# Altium schematic sheet B38_LCM.SchDoc
size A3; SheetNumber: 10; SheetTotal: 11
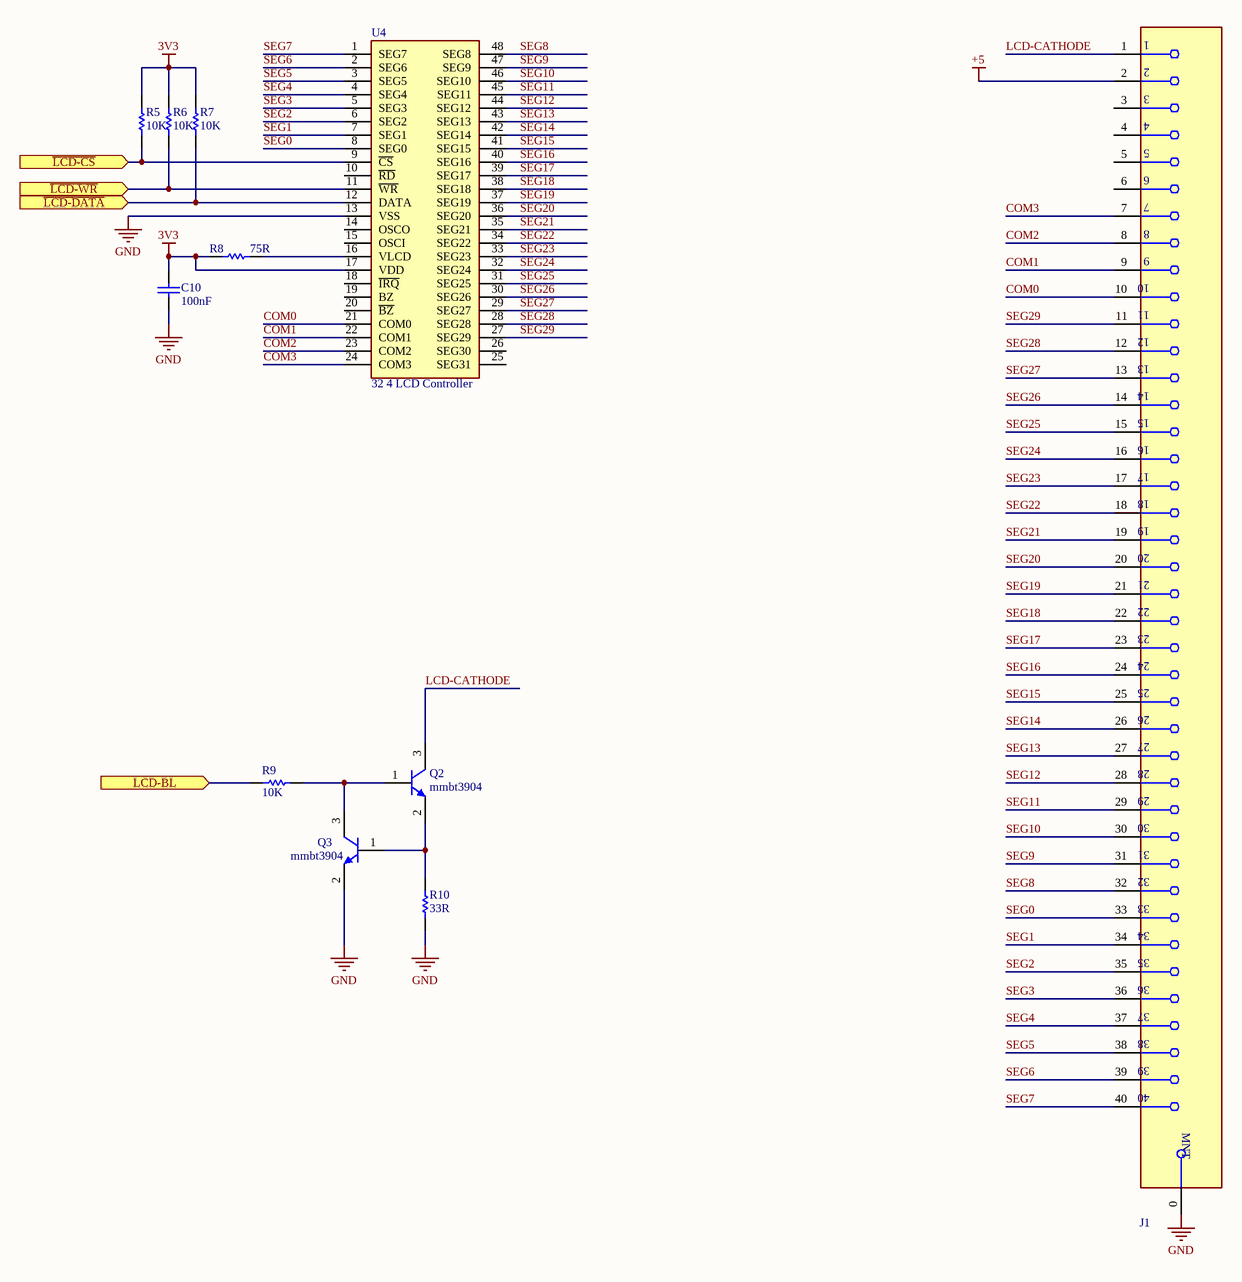
[diagram p0: B38_LCM.SchDoc]

## Parts
C10  100nF  [CAP0603]
J1  4-1734592-0  [FFC40PIN TOP]  (value not drawn)
Q2  mmbt3904  [SOT-23]
Q3  mmbt3904  [SOT-23]
R5  10K  [RES0603]
R6  10K  [RES0603]
R7  10K  [RES0603]
R8  75R  [RES0603]
R9  10K  [RES0603]
R10  33R  [RES0603]
U4  32 4 LCD Controller  [SOP64P1035X277-48N]

## Ports
LCD-BL (in), ~{LCD-CS} (in), ~{LCD-DATA} (in), ~{LCD-WR} (in)

## Nets
3V3: C10.1 R5.1 R6.1 R7.1 R8.1 U4.17(VDD)
+5: J1.2
GND: C10.2 J1.0(MNT_1) Q3.2(E) R10.1 U4.13(VSS)
COM0: J1.10 U4.21(COM0)
COM1: J1.9 U4.22(COM1)
COM2: J1.8 U4.23(COM2)
COM3: J1.7 U4.24(COM3)
~{LCD-CS}: R5.2 U4.9(~{CS}) ; port ~{LCD-CS}
~{LCD-DATA}: R7.2 U4.12(DATA) ; port ~{LCD-DATA}
~{LCD-WR}: R6.2 U4.11(~{WR}) ; port ~{LCD-WR}
LCD-BL: R9.2 ; port LCD-BL
LCD-CATHODE: J1.1 Q2.3(C)
SEG0: J1.33 U4.8(SEG0)
SEG1: J1.34 U4.7(SEG1)
SEG2: J1.35 U4.6(SEG2)
SEG3: J1.36 U4.5(SEG3)
SEG4: J1.37 U4.4(SEG4)
SEG5: J1.38 U4.3(SEG5)
SEG6: J1.39 U4.2(SEG6)
SEG7: J1.40 U4.1(SEG7)
SEG8: J1.32 U4.48(SEG8)
SEG9: J1.31 U4.47(SEG9)
SEG10: J1.30 U4.46(SEG10)
SEG11: J1.29 U4.45(SEG11)
SEG12: J1.28 U4.44(SEG12)
SEG13: J1.27 U4.43(SEG13)
SEG14: J1.26 U4.42(SEG14)
SEG15: J1.25 U4.41(SEG15)
SEG16: J1.24 U4.40(SEG16)
SEG17: J1.23 U4.39(SEG17)
SEG18: J1.22 U4.38(SEG18)
SEG19: J1.21 U4.37(SEG19)
SEG20: J1.20 U4.36(SEG20)
SEG21: J1.19 U4.35(SEG21)
SEG22: J1.18 U4.34(SEG22)
SEG23: J1.17 U4.33(SEG23)
SEG24: J1.16 U4.32(SEG24)
SEG25: J1.15 U4.31(SEG25)
SEG26: J1.14 U4.30(SEG26)
SEG27: J1.13 U4.29(SEG27)
SEG28: J1.12 U4.28(SEG28)
SEG29: J1.11 U4.27(SEG29)
NetQ2_1: Q2.1(B) Q3.3(C) R9.1
NetQ2_2: Q2.2(E) Q3.1(B) R10.2
NetR8_2: R8.2 U4.16(VLCD)

Not connected (* = marked no-connect by the designer): J1 3 4 5 6; U4 10(~{RD}) 14(OSCO) 15(OSCI) 18(~{IRQ}) 19(BZ) 20(~{BZ}) 25(SEG31) 26(SEG30)

## Notes on the sheet
- (in symbol 4-1734592-0) MNT

## Library data of the parts
C10 = Cap: Capacitor; Published: 8-Jun-2000; Revision: July-2002: Re-released for DXP Platform.; Publisher: Altium Limited; Value: 100nF
R5-R10 = Res1: Resistor 5%; Manufacturer: Panasonic; PN: ERJ3GEYJ101V; Value: 100Ω
U4 = HT1621B: Integrated Circuit; Manufacturer_Name: Holtek; Manufacturer_Part_Number: HT1621B(48SSOP); Height: 2.769mm